# Altium schematic sheet KlokWave.Display.SchDoc
size A4; SheetNumber: 3; SheetTotal: 3
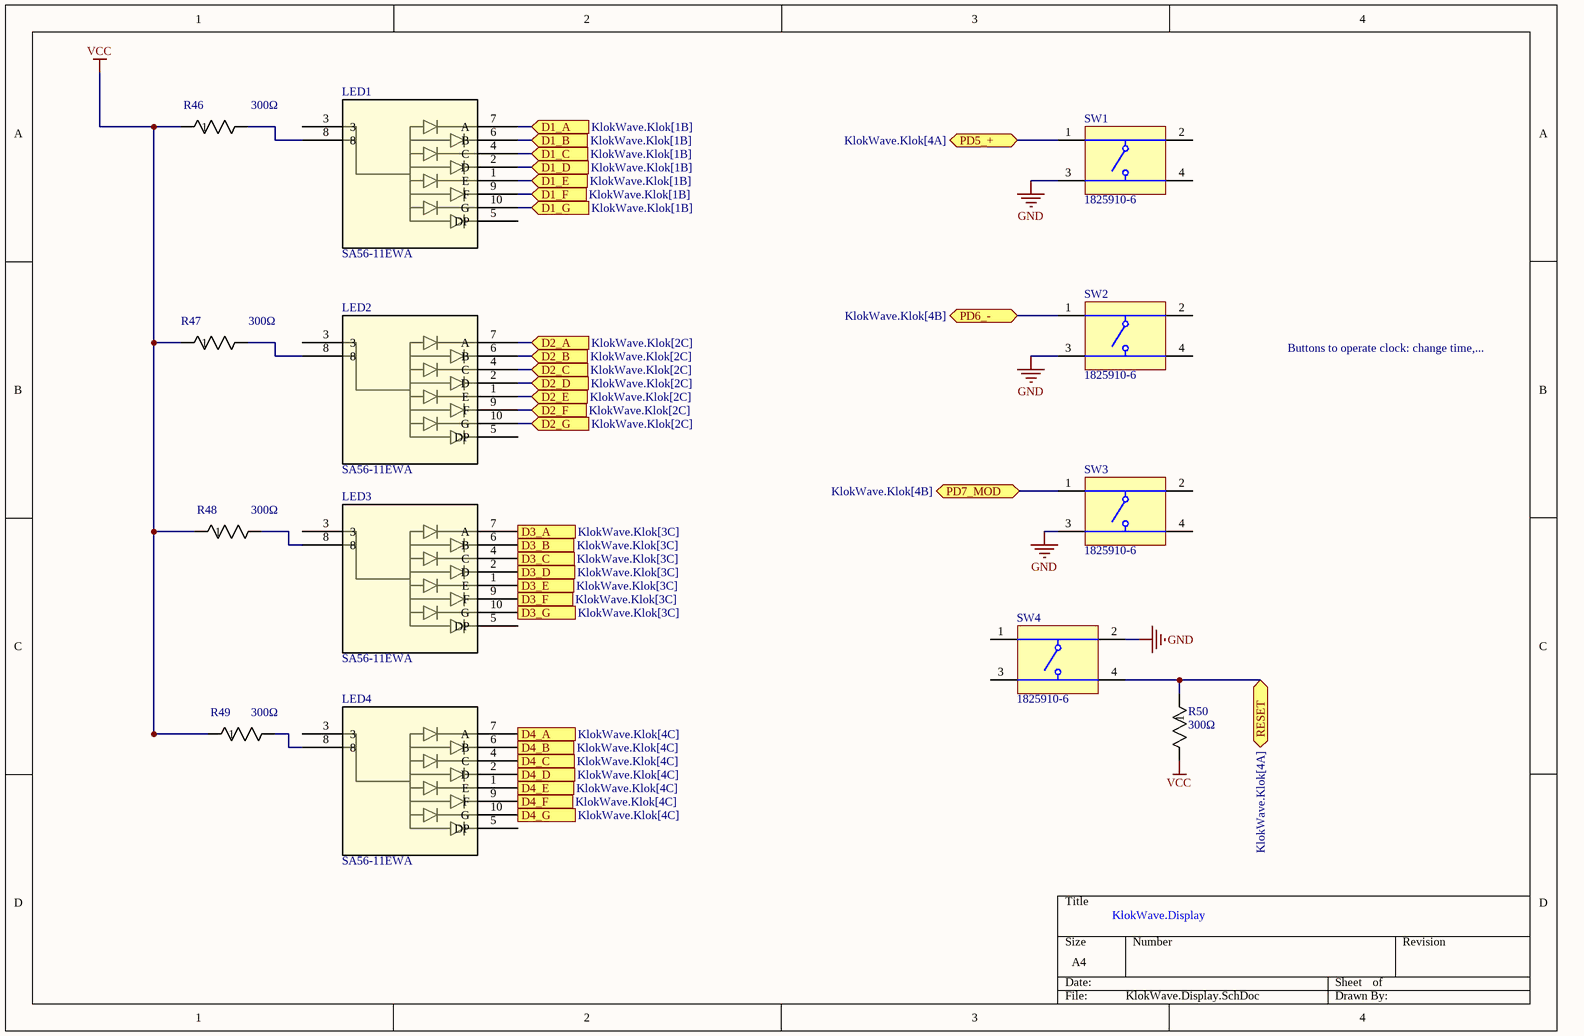
[diagram p0: KlokWave.Display.SchDoc]

## Parts
LED1  SA56-11EWA  [THT 7Seg: LED10_SA56-11EWA_KNB]
LED2  SA56-11EWA  [THT 7Seg: LED10_SA56-11EWA_KNB]
LED3  SA56-11EWA  [THT 7Seg: LED10_SA56-11EWA_KNB]
LED4  SA56-11EWA  [THT 7Seg: LED10_SA56-11EWA_KNB]
R46  Resistance: 300Ω  [THT Resistor: RES_AC03_VIS]  (hidden comment: AC03000003000JAC00)
R47  Resistance: 300Ω  [THT Resistor: RES_AC03_VIS]  (hidden comment: AC03000003000JAC00)
R48  Resistance: 300Ω  [THT Resistor: RES_AC03_VIS]  (hidden comment: AC03000003000JAC00)
R49  Resistance: 300Ω  [THT Resistor: RES_AC03_VIS]  (hidden comment: AC03000003000JAC00)
R50  Resistance: 300Ω  [THT Resistor: RES_AC03_VIS]  (hidden comment: AC03000003000JAC00)
SW1  1825910-6  [THT Button: TECO-1825910-6_V]
SW2  1825910-6  [THT Button: TECO-1825910-6_V]
SW3  1825910-6  [THT Button: TECO-1825910-6_V]
SW4  1825910-6  [THT Button: TECO-1825910-6_V]

## Ports
D1_A (in, see KlokWave.Klok[1B]), D1_B (in, see KlokWave.Klok[1B]), D1_C (in, see KlokWave.Klok[1B]), D1_D (in, see KlokWave.Klok[1B]), D1_E (in, see KlokWave.Klok[1B]), D1_F (in, see KlokWave.Klok[1B]), D1_G (in, see KlokWave.Klok[1B]), D2_A (in, see KlokWave.Klok[2C]), D2_B (in, see KlokWave.Klok[2C]), D2_C (in, see KlokWave.Klok[2C]), D2_D (in, see KlokWave.Klok[2C]), D2_E (in, see KlokWave.Klok[2C]), D2_F (in, see KlokWave.Klok[2C]), D2_G (in, see KlokWave.Klok[2C]), D3_A (in, see KlokWave.Klok[3C]), D3_B (in, see KlokWave.Klok[3C]), D3_C (in, see KlokWave.Klok[3C]), D3_D (in, see KlokWave.Klok[3C]), D3_E (in, see KlokWave.Klok[3C]), D3_F (in, see KlokWave.Klok[3C]), D3_G (in, see KlokWave.Klok[3C]), D4_A (in, see KlokWave.Klok[4C]), D4_B (in, see KlokWave.Klok[4C]), D4_C (in, see KlokWave.Klok[4C]), D4_D (in, see KlokWave.Klok[4C]), D4_E (in, see KlokWave.Klok[4C]), D4_F (in, see KlokWave.Klok[4C]), D4_G (in, see KlokWave.Klok[4C]), PD5_+ (bidir, see KlokWave.Klok[4A]), PD6_- (bidir, see KlokWave.Klok[4B]), PD7_MOD (bidir, see KlokWave.Klok[4B]), RESET (bidir, see KlokWave.Klok[4A])

## Nets
GND: SW1.3 SW2.3 SW3.3 SW4.2
VCC: R46.1 R47.1 R48.1 R49.1 R50.2
D1_A: LED1.7(A) ; port D1_A
D1_B: LED1.6(B) ; port D1_B
D1_C: LED1.4(C) ; port D1_C
D1_D: LED1.2(D) ; port D1_D
D1_E: LED1.1(E) ; port D1_E
D1_F: LED1.9(F) ; port D1_F
D1_G: LED1.10(G) ; port D1_G
D2_A: LED2.7(A) ; port D2_A
D2_B: LED2.6(B) ; port D2_B
D2_C: LED2.4(C) ; port D2_C
D2_D: LED2.2(D) ; port D2_D
D2_E: LED2.1(E) ; port D2_E
D2_F: LED2.9(F) ; port D2_F
D2_G: LED2.10(G) ; port D2_G
D3_A: LED3.7(A) ; port D3_A
D3_B: LED3.6(B) ; port D3_B
D3_C: LED3.4(C) ; port D3_C
D3_D: LED3.2(D) ; port D3_D
D3_E: LED3.1(E) ; port D3_E
D3_F: LED3.9(F) ; port D3_F
D3_G: LED3.10(G) ; port D3_G
D4_A: LED4.7(A) ; port D4_A
D4_B: LED4.6(B) ; port D4_B
D4_C: LED4.4(C) ; port D4_C
D4_D: LED4.2(D) ; port D4_D
D4_E: LED4.1(E) ; port D4_E
D4_F: LED4.9(F) ; port D4_F
D4_G: LED4.10(G) ; port D4_G
PD5_+: SW1.1 ; port PD5_+
PD6_-: SW2.1 ; port PD6_-
PD7_MOD: SW3.1 ; port PD7_MOD
RESET: R50.1 SW4.4 ; port RESET
NetLED1_8: LED1.8 R46.2
NetLED2_8: LED2.8 R47.2
NetLED3_8: LED3.8 R48.2
NetLED4_8: LED4.8 R49.2

Not connected (* = marked no-connect by the designer): LED1 3 5(DP); LED2 3 5(DP); LED3 3 5(DP); LED4 3 5(DP); SW1 2 4; SW2 2 4; SW3 2 4; SW4 1 3

## Notes on the sheet
- Buttons to operate clock: change time,...
- KlokWave.Display

## Library data of the parts
LED1-LED4 = SA56-11EWA: THT CA 7SegDisplay; Mfr_Name: Kingbright; RefDes: RefDes; Type: Type
R46-R50 = CMP-00030-39746760-1: AC03000003000JAC00 Res Wirewound THT; Voltage Rating (DC): 30V; Lead Diameter: 800µm; Max Power Dissipation: 3W; Tolerance: 5%; Temperature Coefficient: -80ppm/°C; Max Operating Temperature: 275°C; Number of Pins: 2; Termination: Axial; Diameter: 4.8mm; Contact Plating: Tin; Packaging: Cut Tape (CT); Schedule B: 8533210080, 8533210080|8533210080|8533210080|8533210080|8533210080; Voltage Rating: 30V; Military Standard: Not; Composition: Wirewound; Power Rating: 3W; NexarPartId: 39746760; Case/Package: Axial; REACH SVHC: Unknown; Min Operating Temperature: -40°C; Thickness: 4.8006mm; Features: Flame Retardant Coating; Width: 4.8mm; Length: 13mm; RoHS: Compliant; Number of Terminations: 2
SW1-SW4 = CMP-1684-00021-1: THT Tact Switch, SPST-NO, 0.05 A, -35 to 85 degC, 4-Pin THD, RoHS, Bulk; Manufacturer: TE Connectivity; Maximum Contact Resistance: 100mOhm; Mechanical Life: 100000Cycles; Bushing Type: Unthreaded; Switch Configuration: OFF(ON); Maximum DC Voltage Rating: 24V; Contact Rating @ Voltage: 0.05A@24VDC; Actuator Color: Black; Body Orientation: Straight; Function: MomentaryContact; Illumination: N/R; Actuator Style: RoundButton; Actuator Material: PolybutyleneTerephthalate; Dielectric Strength: 500VAC; Pole Throw Configuration: SPST; Actuator Length: 1.4mm; Product Weight: N/A; Contact Material: CopperAlloy; Housing Material: N/A; Terminal Type: PCPins; Minimum Insulation Resistance: 100MOhm; Package Description: 4-Pin Through Hole Device, Body 5.99 x 5.99 mm, Pitch 6.5 mm; Part No: 1825910-6; Package Reference: THD; Base Material: N/A; Manufacturer URL: http://www.te.com; Contact Plating: Silver; RoHS: Yes; Datasheet Version: Rev. C9; Electrical Life: 100000Cycles; Maximum AC Voltage Rating: N/A; Thread Size: N/R; Operating Temperature: -35to85C; Mounting: ThroughHole; Dimension: 5.99x5mm; Datasheet URL: http://www.te.com/commerce/DocumentDelivery/DDEController?Action=showdoc&DocId=Customer+Drawing%7F1825910%7FC9%7Fpdf%7FEnglish%7FENG_CD_1825910_C9.pdf%7F1825910-6; Family: 1825910; Seal Location: N/A; Seal Description: N/A; Packaging: N/A